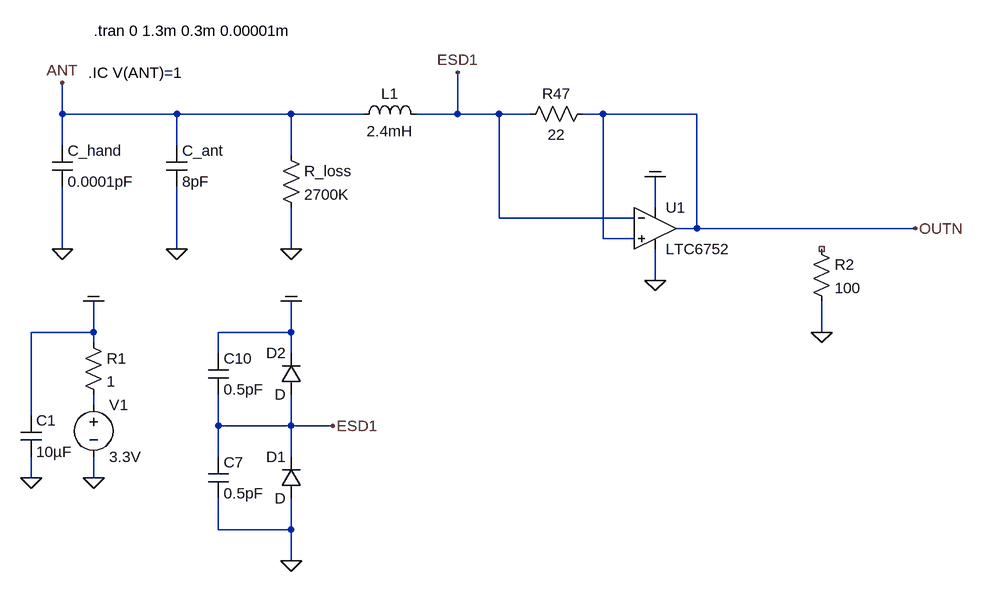
[diagram p0: schematic 2020_current_sense_comparator_square_drive_osc_v05.asc]
2020_current_sense_comparator_square_drive_osc_v05.asc, the LTspice schematic file:
Version 4
SHEET 1 3920 3748
WIRE -592 496 -592 448
WIRE -416 496 -592 496
WIRE -240 496 -416 496
WIRE -128 496 -240 496
WIRE 16 496 16 432
WIRE 16 496 -48 496
WIRE 80 496 16 496
WIRE 128 496 80 496
WIRE 240 496 208 496
WIRE 384 496 240 496
WIRE -592 544 -592 496
WIRE -416 544 -416 496
WIRE -240 560 -240 496
WIRE 320 640 320 592
WIRE 80 656 80 496
WIRE 288 656 80 656
WIRE 384 672 384 496
WIRE 384 672 352 672
WIRE 720 672 384 672
WIRE 240 688 240 496
WIRE 288 688 240 688
WIRE -592 704 -592 608
WIRE -416 704 -416 608
WIRE -240 704 -240 640
WIRE 320 752 320 704
WIRE -544 832 -544 784
WIRE -544 832 -640 832
WIRE -240 832 -240 784
WIRE -240 832 -352 832
WIRE 576 832 576 784
WIRE -544 848 -544 832
WIRE -352 864 -352 832
WIRE -240 864 -240 832
WIRE -544 944 -544 928
WIRE -640 960 -640 832
WIRE -352 976 -352 928
WIRE -240 976 -240 928
WIRE -240 976 -352 976
WIRE -176 976 -240 976
WIRE -352 1024 -352 976
WIRE -240 1024 -240 976
WIRE -640 1056 -640 1024
WIRE -544 1056 -544 1024
WIRE -352 1136 -352 1088
WIRE -240 1136 -240 1088
WIRE -240 1136 -352 1136
WIRE -240 1184 -240 1136
FLAG -544 1056 0
FLAG -544 784 COM
FLAG -240 1184 0
FLAG -240 784 COM
FLAG -176 976 ESD1
FLAG -592 448 ANT
FLAG -592 704 0
FLAG -416 704 0
FLAG -240 704 0
FLAG 16 432 ESD1
FLAG -640 1056 0
FLAG 320 592 COM
FLAG 320 752 0
FLAG 720 672 OUTN
FLAG 576 832 0
SYMBOL voltage -544 928 R0
WINDOW 123 0 0 Left 0
WINDOW 39 0 0 Left 0
SYMATTR InstName V1
SYMATTR Value 3.3V
SYMBOL diode -224 1088 R180
WINDOW 0 24 64 Left 2
WINDOW 3 24 0 Left 2
SYMATTR InstName D1
SYMBOL diode -224 928 R180
WINDOW 0 24 64 Left 2
WINDOW 3 24 0 Left 2
SYMATTR InstName D2
SYMBOL cap -368 1024 R0
SYMATTR InstName C7
SYMATTR Value 0.5pF
SYMBOL cap -368 864 R0
SYMATTR InstName C10
SYMATTR Value 0.5pF
SYMBOL ind -144 512 R270
WINDOW 0 32 56 VTop 2
WINDOW 3 5 56 VBottom 2
SYMATTR InstName L1
SYMATTR Value 2.4mH
SYMATTR SpiceLine Rser=85 Rpar=10Meg Cpar=1.216pF
SYMBOL cap -432 544 R0
SYMATTR InstName C_ant
SYMATTR Value 8pF
SYMBOL cap -608 544 R0
SYMATTR InstName C_hand
SYMATTR Value 0.0001pF
SYMBOL res -256 544 R0
SYMATTR InstName R_loss
SYMATTR Value 2700K
SYMBOL res 112 512 R270
WINDOW 0 32 56 VTop 2
WINDOW 3 0 56 VBottom 2
SYMATTR InstName R47
SYMATTR Value 22
SYMBOL res -560 832 R0
SYMATTR InstName R1
SYMATTR Value 1
SYMBOL cap -656 960 R0
SYMATTR InstName C1
SYMATTR Value 10µF
SYMBOL Comparators\\LTC6752 320 608 R0
SYMATTR InstName U1
SYMBOL res 560 688 R0
SYMATTR InstName R2
SYMATTR Value 100
TEXT -544 368 Left 2 !.tran 0 1.3m 0.3m 0.00001m
TEXT -552 432 Left 2 !.IC V(ANT)=1

The netlist it stands for:
* 2020_current_sense_comparator_square_drive_osc_v05.asc
V1 N001 0 3.3V
D1 0 ESD1 D
D2 ESD1 COM D
C7 ESD1 0 0.5pF
C10 COM ESD1 0.5pF
L1 ANT ESD1 2.4mH Rser=85 Rpar=10Meg Cpar=1.216pF
C_ant ANT 0 8pF
C_hand ANT 0 0.0001pF
R_loss ANT 0 2700K
R47 ESD1 OUTN 22
R1 COM N001 1
C1 COM 0 10µF
XU1 OUTN ESD1 COM 0 OUTN LTC6752  ; pins In+ In- V+ V- OUT
R2 NC_01 0 100
.model D D
.lib standard.dio
.tran 0 1.3m 0.3m 0.00001m
.IC V(ANT)=1
.lib LTC7.lib
.backanno
.end